# Altium schematic sheet PSU.SchDoc
size A4
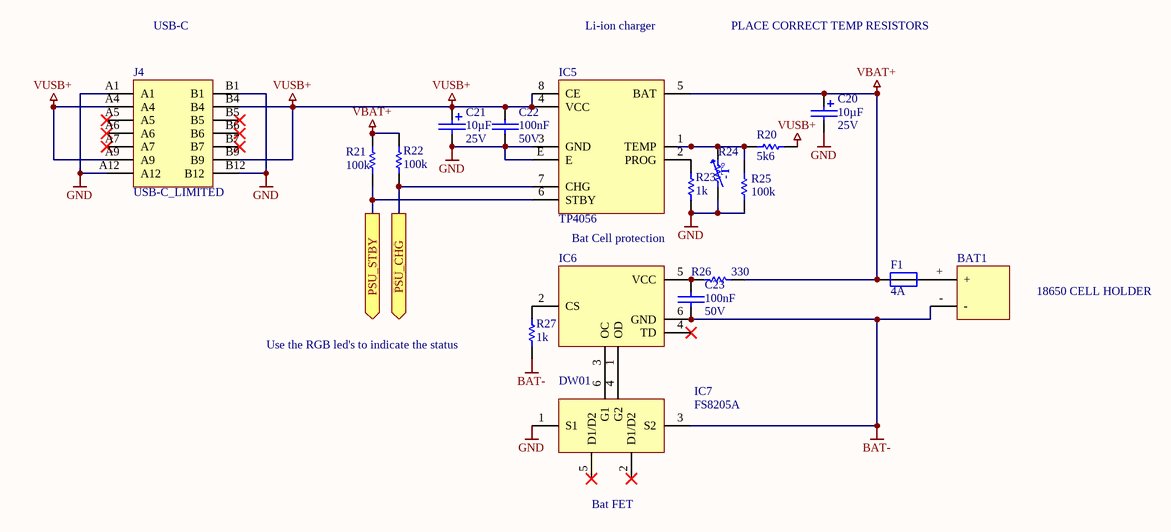
[diagram p0: PSU.SchDoc]

## Parts
BAT1  18650 CELL HOLDER  [T353]
C20  value 10µF  voltage: 25V  [CD6.3H12TH]  (hidden comment: cap-pol)
C21  value 10µF  voltage: 25V  [CD6.3H12TH]  (hidden comment: cap-pol)
C22  value 100nF  voltage: 50V  [TH5.08]  (hidden comment: cap_non_pol)
C23  value 100nF  voltage: 50V  [TH5.08]  (hidden comment: cap_non_pol)
F1  value 4A  [F0603]  (hidden comment: fuse)
IC5  TP4056
IC6  DW01  [SOT-23-6]
IC7  FS8205A  [SOT-23-6]
J4  USB-C_LIMITED  [GT-USB-7037]
R20  value 5k6  [TH6.3]  (hidden comment: resistor)
R21  value 100k  [TH6.3]  (hidden comment: resistor)
R22  value 100k  [TH6.3]  (hidden comment: resistor)
R23  value 1k  [TH6.3]  (hidden comment: resistor)
R24  thermistor  [TH6.3]  (value not drawn)
R25  value 100k  [TH6.3]  (hidden comment: resistor)
R26  value 330  [TH6.3]  (hidden comment: resistor)
R27  value 1k  [TH6.3]  (hidden comment: resistor)

## Ports
PSU_CHG (out), PSU_STBY (out)

## Nets
BAT-: BAT1.- C23.2 IC6.6(GND) IC7.3(S2) R27.2
GND: C20.- C21.- C22.2 IC5.3(GND) IC5.E IC7.1(S1) J4.A1 J4.A12 J4.B1 J4.B12 R23.2 R24.1 R25.1
VBAT+: C20.+ F1.1 IC5.5(BAT) R21.2 R22.1 R26.2
VUSB+: C21.+ C22.1 IC5.4(VCC) IC5.8(CE) J4.A4 J4.A9 J4.B4 J4.B9 R20.2
PSU_CHG: IC5.7(CHG) R22.2 ; port PSU_CHG
PSU_STBY: IC5.6(STBY) R21.1 ; port PSU_STBY
NetBAT1_+: BAT1.+ F1.2
NetC23_1: C23.1 IC6.5(VCC) R26.1
NetIC5_1: IC5.1(TEMP) R20.1 R24.2 R25.2
NetIC5_2: IC5.2(PROG) R23.1
NetIC6_1: IC6.1(OD) IC7.4(G2)
NetIC6_2: IC6.2(CS) R27.1
NetIC6_3: IC6.3(OC) IC7.6(G1)

Not connected (* = marked no-connect by the designer): IC6 4(TD)*; IC7 2(D1/D2)* 5(D1/D2)*; J4 A5* A6* A7* B5* B6* B7*

## Notes on the sheet
- USB-C
- Li-ion charger
- PLACE CORRECT TEMP RESISTORS
- Bat Cell protection
- (near R27) Use the RGB led's to indicate the status
- (near IC7) Bat FET
- (in symbol 4) -T°

## Library data of the parts
BAT1 = 12: 18650 single cell Battery holder; manufacturer: GTIWUNG; id: 12; manufacturer_ref: T353; type: Battery holder; package: T353; supplier_1: amazon; supplier_1_partnumber: B08CY56M98; price: 0,99; status: active
C20 C21 = 4: CAP ALUM 10UF 20% 25V TH; manufacturer_ref: ECF1KM100E12OTPO; manufacturer: Yunxing; id: 4; dielectric: Aluminium; tolerance: 20%; package: d6,3h12TH; supplier_1: lcsc; supplier_1_partnumber: C2841587; price: 0,0229; status: active
C22 C23 = 37: CAP CER TH 100nF X7R 50V; manufacturer_ref: C2761753; manufacturer: FH; id: 37; tolerance: 10%; dielectric: X7R; package: TH5.08; supplier_1: lcsc; supplier_1_partnumber: C385200; price: 0,0237; status: active
F1 = 8: FUSE BOARD MOUNT 4A 32VDC 0603; manufacturer_ref: MFU0603FF04000P500; manufacturer: Vishay Beyschlag/Draloric/BC Components; id: 8; response_time: FAST; package: 0603; supplier_1: digikey; supplier_1_partnumber: 749-MFU0603FF04000P500CT-ND; price: 0,22; status: active
IC6 = 59: IC  Battery Management IC; manufacturer_ref: DW01+G; manufacturer: Fortune Semicon; id: 59; type: PMIC (Battery Management); package: SOT-23-6; supplier_1: lcsc; supplier_1_partnumber: C14213; price: 0,153; status: active
IC7 = 60: IC  MOSFET Array 3A; manufacturer: TECH PUBLIC; id: 60; manufacturer_ref: FS8205A; type: MOSFET ARRAY; package: SOT-23-6; supplier_1: lcsc; supplier_1_partnumber: C2830320; price: 0,06; status: active
J4 = 30: USB TYPE C , RECEPTACLE, R/A; manufacturer: G-Switch; id: 30; nbr_positions_total: 14; manufacturer_ref: GT-USB-7037; package: USB-C_LIMITED; supplier_1: lcsc; supplier_1_partnumber: C2762981; price: 0,4797; status: active
R20 = 64: RES TH 4k12 OHM 1% 1/4W; manufacturer_ref: MFR0W4F5601A50; manufacturer: UNI-ROYAL(Uniroyal Elec); id: 64; tolerance: 0,01; power: 1/4W; package: TH6,3; supplier_1: lcsc; supplier_1_partnumber: C58603; price: 0,02; status: active
R21 R22 R25 = 56: RES TH 100k OHM 5% 1/4W; manufacturer_ref: CR1/4W-100K±5%-RT52; manufacturer: VO; id: 56; tolerance: 5%; power: 1/4W; package: TH6.3; supplier_1: lcsc; supplier_1_partnumber: C2894520; price: 0,0038; status: active
R23 R27 = 57: RES TH 1k OHM 5% 1/4W; manufacturer_ref: CR1/4W-1K±5%-OT52; manufacturer: VO; id: 57; tolerance: 5%; power: 1/4W; package: TH6.3; supplier_1: lcsc; supplier_1_partnumber: C2894570; price: 0,0038; status: active
R24 = 4: THERMISTOR NTC 10KOHM 3435K BEAD; manufacturer_ref: MF58 103J3435; manufacturer: Nanjing Shiheng Elec; id: 4; value: 10k; tolerance: 5%; power: 1/20W; type: NTC_THERMISTOR; package: TH6.3; supplier_1: lcsc; supplier_1_partnumber: C123389; price: 0,0059; status: active
R26 = 58: RES TH 330 OHM 5% 1/4W; manufacturer_ref: CR1/4W-330Ω±5%-OT52; manufacturer: VO; id: 58; tolerance: 5%; power: 1/4W; package: TH6.3; supplier_1: lcsc; supplier_1_partnumber: C2894590; price: 0,0041; status: active